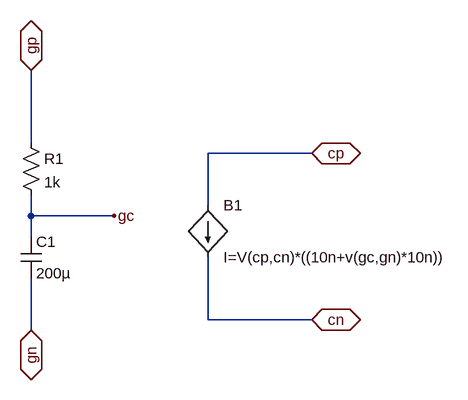
[diagram p0: schematic Capteur_gaz.asc]
Capteur_gaz.asc, the LTspice schematic file:
Version 4
SHEET 1 880 680
WIRE -80 32 -80 -80
WIRE 352 48 192 48
WIRE 192 128 192 48
WIRE -80 144 -80 112
WIRE 48 144 -80 144
WIRE -80 176 -80 144
WIRE 192 304 192 208
WIRE 352 304 192 304
WIRE -80 320 -80 240
FLAG 352 48 cp
IOPIN 352 48 BiDir
FLAG 352 304 cn
IOPIN 352 304 BiDir
FLAG -80 -80 gp
IOPIN -80 -80 BiDir
FLAG -80 320 gn
IOPIN -80 320 BiDir
FLAG 48 144 gc
SYMBOL bi 192 128 R0
SYMATTR InstName B1
SYMATTR Value I=V(cp,cn)*((10n+v(gc,gn)*10n))
SYMBOL res -96 16 R0
SYMATTR InstName R1
SYMATTR Value 1k
SYMBOL cap -96 176 R0
SYMATTR InstName C1
SYMATTR Value 200µ

The netlist it stands for:
* Capteur_gaz.asc
B1 cp cn I=V(cp,cn)*((10n+v(gc,gn)*10n))
R1 gp gc 1k
C1 gc gn 200µ
.backanno
.end